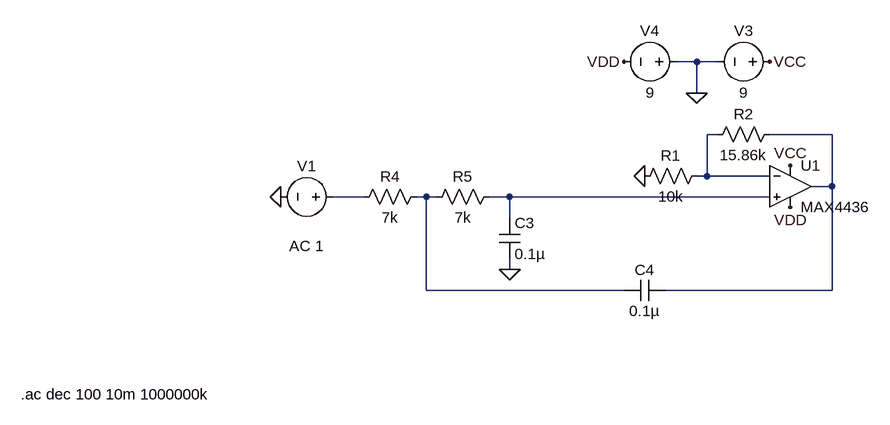
[diagram p0: schematic Salen Key.asc]
Salen Key.asc, the LTspice schematic file:
Version 4
SHEET 1 1204 680
WIRE 928 -48 896 -48
WIRE 960 -48 928 -48
WIRE 928 0 928 -48
WIRE 960 64 944 64
WIRE 1136 64 1040 64
WIRE 944 128 944 64
WIRE 944 128 928 128
WIRE 1040 128 944 128
WIRE 1136 144 1136 64
WIRE 1136 144 1104 144
WIRE 416 160 368 160
WIRE 512 160 496 160
WIRE 528 160 512 160
WIRE 640 160 608 160
WIRE 1040 160 640 160
WIRE 640 192 640 160
WIRE 640 272 640 256
WIRE 512 304 512 160
WIRE 816 304 512 304
WIRE 1136 304 1136 144
WIRE 1136 304 880 304
FLAG 928 0 0
FLAG 1040 -48 VCC
FLAG 816 -48 VDD
FLAG 1072 112 VCC
FLAG 1072 176 VDD
FLAG 288 160 0
FLAG 848 128 0
FLAG 640 272 0
SYMBOL voltage 1056 -48 R90
WINDOW 0 -32 56 VBottom 2
WINDOW 3 32 56 VTop 2
SYMATTR InstName V3
SYMATTR Value 9
SYMBOL voltage 912 -48 R90
WINDOW 0 -32 56 VBottom 2
WINDOW 3 32 56 VTop 2
SYMATTR InstName V4
SYMATTR Value 9
SYMBOL res 512 144 R90
WINDOW 0 0 56 VBottom 2
WINDOW 3 32 56 VTop 2
SYMATTR InstName R4
SYMATTR Value 7k
SYMBOL res 624 144 R90
WINDOW 0 0 56 VBottom 2
WINDOW 3 32 56 VTop 2
SYMATTR InstName R5
SYMATTR Value 7k
SYMBOL cap 624 192 R0
SYMATTR InstName C3
SYMATTR Value 0.1µ
SYMBOL voltage 384 160 R90
WINDOW 0 -32 56 VBottom 2
WINDOW 3 32 56 VTop 2
WINDOW 123 60 56 VTop 2
WINDOW 39 0 0 Left 0
SYMATTR InstName V1
SYMATTR Value ""
SYMATTR Value2 AC 1
SYMBOL res 944 112 R90
WINDOW 0 0 56 VBottom 2
WINDOW 3 32 56 VTop 2
SYMATTR InstName R1
SYMATTR Value 10k
SYMBOL res 1056 48 R90
WINDOW 0 0 56 VBottom 2
WINDOW 3 32 56 VTop 2
SYMATTR InstName R2
SYMATTR Value 15.86k
SYMBOL cap 880 288 R90
WINDOW 0 0 32 VBottom 2
WINDOW 3 32 32 VTop 2
SYMATTR InstName C4
SYMATTR Value 0.1µ
SYMBOL OpAmps\\MAX4436 1072 80 R0
SYMATTR InstName U1
TEXT -112 464 Left 2 !.ac dec 100 10m 1000000k

The netlist it stands for:
* Salen Key.asc
V3 VCC 0 9
V4 0 VDD 9
R4 N004 N003 7k
R5 N005 N004 7k
C3 N005 0 0.1µ
V1 N003 0 AC 1
R1 N001 0 10k
R2 N002 N001 15.86k
C4 N002 N004 0.1µ
XU1 N005 N001 VCC VDD N002 MAX4436  ; pins In+ In- V+ V- OUT
.ac dec 100 10m 1000000k
.backanno
.end